# EAGLE schematic at32uc3_proto1 (EAGLE 5.10)
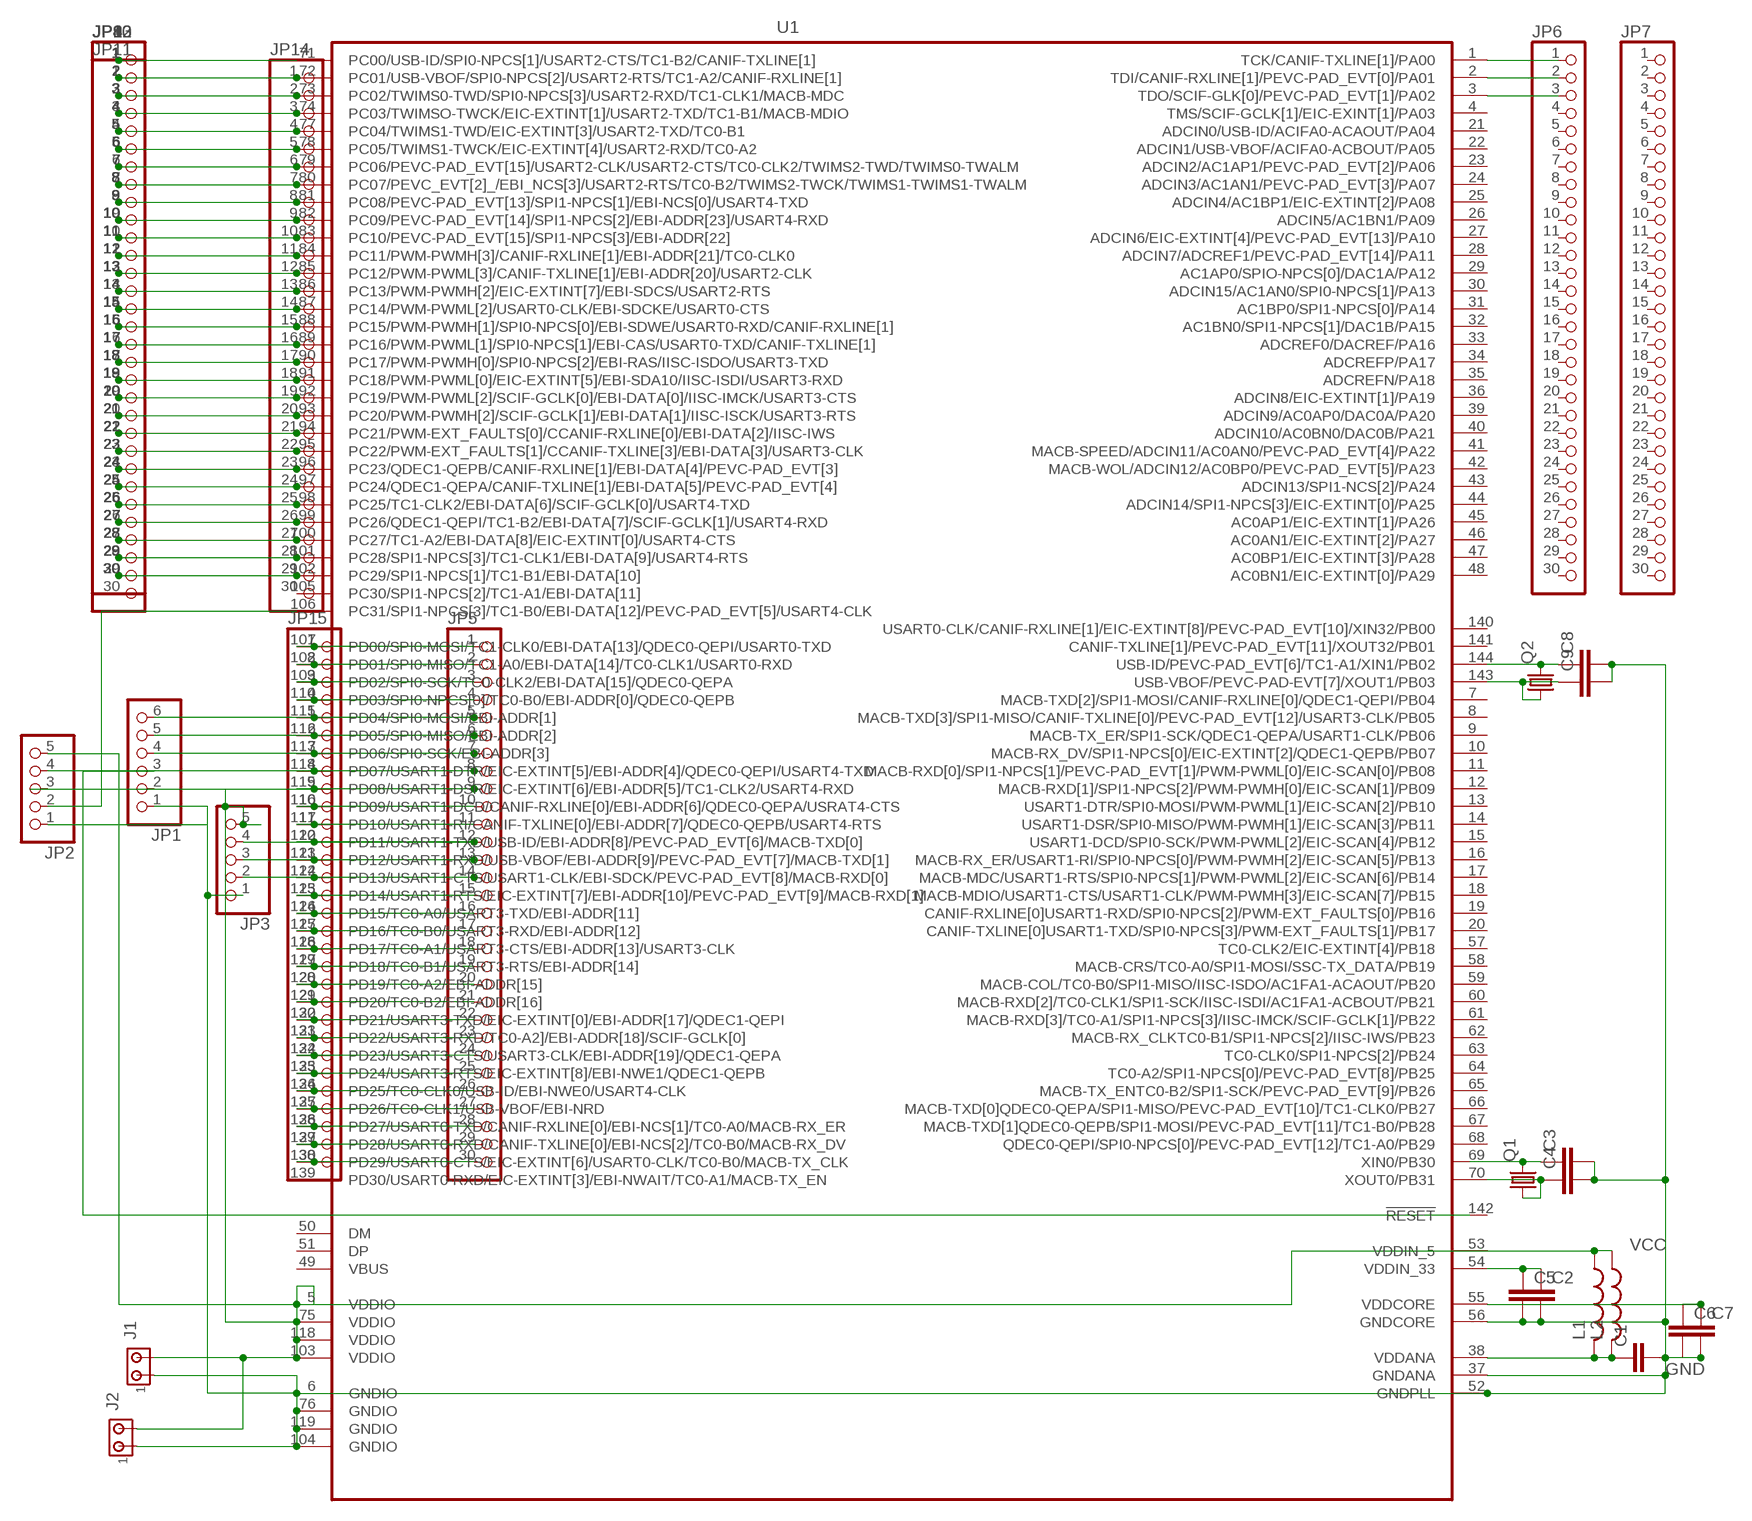
[diagram p0: schematic, sheet 1]

## Parts
C1  C-EU025-050X050  [C025-050X050]
C2  C-EUC1206K  [C1206K]
C3  C-EUC1206K  [C1206K]
C4  C-EUC1206K  [C1206K]
C5  C-EUC1206K  [C1206K]
C6  C-EUC1206K  [C1206K]
C7  C-EUC1206K  [C1206K]
C8  C-EUC1206K  [C1206K]
C9  C-EUC1206K  [C1206K]
J1  MTA02-100  [10X02MTA]
J2  MTA02-100  [10X02MTA]
JP1  PINHD-1X6  [1X06]
JP2  PINHD-1X5  [1X05]
JP3  PINHD-1X5  [1X05]
JP4  PINHD-1X30  [1X30]
JP5  PINHD-1X30  [1X30]
JP6  PINHD-1X30  [1X30]
JP7  PINHD-1X30  [1X30]
JP8  PINHD-1X30  [1X30]
JP9  PINHD-1X30  [1X30]
JP10  PINHD-1X30  [1X30]
JP11  PINHD-1X30  [1X30]
JP12  PINHD-1X30  [1X30]
JP13  PINHD-1X30  [1X30]
JP14  PINHD-1X30  [1X30]
JP15  PINHD-1X30  [1X30]
L1  L-US0207/10  [0207/10]
L2  L-USL4532C  [L4532M]
Q1  CRYSTALHC49S  [HC49/S]
Q2  CRYSTALHC49S  [HC49/S]
U1  AT32UC3C0128/0256/0512  [LQFP144]

## Nets
GND: C1.2 C2.2 C3.2 C4.2 C5.2 C6.2 C7.2 C8.2 C9.2 J1.1 J2.1 JP1.1 JP2.1 JP3.1 U1.6(GNDIO) U1.37(GNDANA) U1.52(GNDPLL) U1.56(GNDCORE) U1.76(GNDIO) U1.104(GNDIO) U1.119(GNDIO)
N$1: C2.1 C5.1 U1.54(VDDIN_33)
N$2: C4.1 Q1.1 U1.70(XOUT0/PB31)
N$3: C1.1 L1.2 L2.2 U1.38(VDDANA)
N$4: C3.1 Q1.2
N$5: C6.1 C7.1 U1.55(VDDCORE)
N$6: C8.1 Q2.2 U1.144(USB-ID/PEVC-PAD_EVT[6]/TC1-A1/XIN1/PB02)
N$7: C9.1 Q2.1 U1.143(USB-VBOF/PEVC-PAD-EVT[7]/XOUT1/PB03)
N$8: JP1.6 JP5.5 JP15.5 U1.111(PD04/SPI0-MOSI/EBI-ADDR[1])
N$9: JP1.5 JP5.6 JP15.6 U1.112(PD05/SPI0-MISO/EBI-ADDR[2])
N$10: JP1.4 JP5.7 JP15.7 U1.113(PD06/SPI0-SCK/EBI-ADDR[3])
N$11: JP1.3
N$12: JP2.4 JP5.8 JP15.8 U1.114(PD07/USART1-DTR/EIC-EXTINT[5]/EBI-ADDR[4]/QDEC0-QEPI/USART4-TXD)
N$13: JP5.9 JP15.9 U1.115(PD08/USART1-DSR/EIC-EXTINT[6]/EBI-ADDR[5]/TC1-CLK2/USART4-RXD)
N$14: JP2.2 U1.106(PC31/SPI1-NPCS[3]/TC1-B0/EBI-DATA[12]/PEVC-PAD_EVT[5]/USART4-CLK)
N$15: JP4.1 JP8.1 JP9.1 JP10.1 JP12.1 JP13.1 U1.71(PC00/USB-ID/SPI0-NPCS[1]/USART2-CTS/TC1-B2/CANIF-TXLINE[1])
N$16: JP3.4 JP5.12 JP15.12 U1.120(PD11/USART1-TXD/USB-ID/EBI-ADDR[8]/PEVC-PAD_EVT[6]/MACB-TXD[0])
N$17: JP3.3 JP5.13 JP15.13 U1.121(PD12/USART1-RXD/USB-VBOF/EBI-ADDR[9]/PEVC-PAD_EVT[7]/MACB-TXD[1])
N$18: JP3.2 JP5.14 JP15.14 U1.122(PD13/USART1-CTS/USART1-CLK/EBI-SDCK/PEVC-PAD_EVT[8]/MACB-RXD[0])
N$19: JP4.2 JP8.2 JP9.2 JP10.2 JP11.1 JP12.2 JP13.2 JP14.1 U1.72(PC01/USB-VBOF/SPI0-NPCS[2]/USART2-RTS/TC1-A2/CANIF-RXLINE[1])
N$20: JP4.3 JP8.3 JP9.3 JP10.3 JP11.2 JP12.3 JP13.3 JP14.2 U1.73(PC02/TWIMS0-TWD/SPI0-NPCS[3]/USART2-RXD/TC1-CLK1/MACB-MDC)
N$21: JP4.4 JP8.4 JP9.4 JP10.4 JP11.3 JP12.4 JP13.4 JP14.3 U1.74(PC03/TWIMSO-TWCK/EIC-EXTINT[1]/USART2-TXD/TC1-B1/MACB-MDIO)
N$22: JP4.5 JP8.5 JP9.5 JP10.5 JP11.4 JP12.5 JP13.5 JP14.4 U1.77(PC04/TWIMS1-TWD/EIC-EXTINT[3]/USART2-TXD/TC0-B1)
N$23: JP4.6 JP8.6 JP9.6 JP10.6 JP11.5 JP12.6 JP13.6 JP14.5 U1.78(PC05/TWIMS1-TWCK/EIC-EXTINT[4]/USART2-RXD/TC0-A2)
N$24: JP4.7 JP8.7 JP9.7 JP10.7 JP11.6 JP12.7 JP13.7 JP14.6 U1.79(PC06/PEVC-PAD_EVT[15]/USART2-CLK/USART2-CTS/TC0-CLK2/TWIMS2-TWD/TWIMS0-TWALM)
N$25: JP4.8 JP8.8 JP9.8 JP10.8 JP11.7 JP12.8 JP13.8 JP14.7 U1.80(PC07/PEVC_EVT[2]_/EBI_NCS[3]/USART2-RTS/TC0-B2/TWIMS2-TWCK/TWIMS1-TWIMS1-TWALM)
N$26: JP4.9 JP8.9 JP9.9 JP10.9 JP11.8 JP12.9 JP13.9 JP14.8 U1.81(PC08/PEVC-PAD_EVT[13]/SPI1-NPCS[1]/EBI-NCS[0]/USART4-TXD)
N$27: JP4.10 JP8.10 JP9.10 JP10.10 JP11.9 JP12.10 JP13.10 JP14.9 U1.82(PC09/PEVC-PAD_EVT[14]/SPI1-NPCS[2]/EBI-ADDR[23]/USART4-RXD)
N$28: JP4.11 JP8.11 JP9.11 JP10.11 JP11.10 JP12.11 JP13.11 JP14.10 U1.83(PC10/PEVC-PAD_EVT[15]/SPI1-NPCS[3]/EBI-ADDR[22])
N$29: JP4.12 JP8.12 JP9.12 JP10.12 JP11.11 JP12.12 JP13.12 JP14.11 U1.84(PC11/PWM-PWMH[3]/CANIF-RXLINE[1]/EBI-ADDR[21]/TC0-CLK0)
N$30: JP4.13 JP8.13 JP9.13 JP10.13 JP11.12 JP12.13 JP13.13 JP14.12 U1.85(PC12/PWM-PWML[3]/CANIF-TXLINE[1]/EBI-ADDR[20]/USART2-CLK)
N$31: JP4.14 JP8.14 JP9.14 JP10.14 JP11.13 JP12.14 JP13.14 JP14.13 U1.86(PC13/PWM-PWMH[2]/EIC-EXTINT[7]/EBI-SDCS/USART2-RTS)
N$32: JP4.15 JP8.15 JP9.15 JP10.15 JP11.14 JP12.15 JP13.15 JP14.14 U1.87(PC14/PWM-PWML[2]/USART0-CLK/EBI-SDCKE/USART0-CTS)
N$33: JP4.16 JP8.16 JP9.16 JP10.16 JP11.15 JP12.16 JP13.16 JP14.15 U1.88(PC15/PWM-PWMH[1]/SPI0-NPCS[0]/EBI-SDWE/USART0-RXD/CANIF-RXLINE[1])
N$34: JP4.17 JP8.17 JP9.17 JP10.17 JP11.16 JP12.17 JP13.17 JP14.16 U1.89(PC16/PWM-PWML[1]/SPI0-NPCS[1]/EBI-CAS/USART0-TXD/CANIF-TXLINE[1])
N$35: JP4.18 JP8.18 JP9.18 JP10.18 JP11.17 JP12.18 JP13.18 JP14.17 U1.90(PC17/PWM-PWMH[0]/SPI0-NPCS[2]/EBI-RAS/IISC-ISDO/USART3-TXD)
N$36: JP4.19 JP8.19 JP9.19 JP10.19 JP11.18 JP12.19 JP13.19 JP14.18 U1.91(PC18/PWM-PWML[0]/EIC-EXTINT[5]/EBI-SDA10/IISC-ISDI/USART3-RXD)
N$37: JP4.20 JP8.20 JP9.20 JP10.20 JP11.19 JP12.20 JP13.20 JP14.19 U1.92(PC19/PWM-PWML[2]/SCIF-GCLK[0]/EBI-DATA[0]/IISC-IMCK/USART3-CTS)
N$38: JP4.21 JP8.21 JP9.21 JP10.21 JP11.20 JP12.21 JP13.21 JP14.20 U1.93(PC20/PWM-PWMH[2]/SCIF-GCLK[1]/EBI-DATA[1]/IISC-ISCK/USART3-RTS)
N$39: JP4.22 JP8.22 JP9.22 JP10.22 JP11.21 JP12.22 JP13.22 JP14.21 U1.94(PC21/PWM-EXT_FAULTS[0]/CCANIF-RXLINE[0]/EBI-DATA[2]/IISC-IWS)
N$40: JP4.23 JP8.23 JP9.23 JP10.23 JP11.22 JP12.23 JP13.23 JP14.22 U1.95(PC22/PWM-EXT_FAULTS[1]/CCANIF-TXLINE[3]/EBI-DATA[3]/USART3-CLK)
N$41: JP4.24 JP8.24 JP9.24 JP10.24 JP11.23 JP12.24 JP13.24 JP14.23 U1.96(PC23/QDEC1-QEPB/CANIF-RXLINE[1]/EBI-DATA[4]/PEVC-PAD_EVT[3])
N$42: JP4.25 JP8.25 JP9.25 JP10.25 JP11.24 JP12.25 JP13.25 JP14.24 U1.97(PC24/QDEC1-QEPA/CANIF-TXLINE[1]/EBI-DATA[5]/PEVC-PAD_EVT[4])
N$43: JP4.26 JP8.26 JP9.26 JP10.26 JP11.25 JP12.26 JP13.26 JP14.25 U1.98(PC25/TC1-CLK2/EBI-DATA[6]/SCIF-GCLK[0]/USART4-TXD)
N$44: JP4.27 JP8.27 JP9.27 JP10.27 JP11.26 JP12.27 JP13.27 JP14.26 U1.99(PC26/QDEC1-QEPI/TC1-B2/EBI-DATA[7]/SCIF-GCLK[1]/USART4-RXD)
N$45: JP4.28 JP8.28 JP9.28 JP10.28 JP11.27 JP12.28 JP13.28 JP14.27 U1.100(PC27/TC1-A2/EBI-DATA[8]/EIC-EXTINT[0]/USART4-CTS)
N$46: JP4.29 JP8.29 JP9.29 JP10.29 JP11.28 JP12.29 JP13.29 JP14.28 U1.101(PC28/SPI1-NPCS[3]/TC1-CLK1/EBI-DATA[9]/USART4-RTS)
N$47: JP4.30 JP8.30 JP9.30 JP10.30 JP11.29 JP12.30 JP13.30 JP14.29 U1.102(PC29/SPI1-NPCS[1]/TC1-B1/EBI-DATA[10])
N$48: JP5.1 JP15.1 U1.107(PD00/SPI0-MOSI/TC1-CLK0/EBI-DATA[13]/QDEC0-QEPI/USART0-TXD)
N$49: JP5.2 JP15.2 U1.108(PD01/SPI0-MISO/TC1-A0/EBI-DATA[14]/TC0-CLK1/USART0-RXD)
N$50: JP5.3 JP15.3 U1.109(PD02/SPI0-SCK/TC0-CLK2/EBI-DATA[15]/QDEC0-QEPA)
N$51: JP5.4 JP15.4 U1.110(PD03/SPI0-NPCS[0]/TC0-B0/EBI-ADDR[0]/QDEC0-QEPB)
N$52: JP5.10 JP15.10 U1.116(PD09/USART1-DCD/CANIF-RXLINE[0]/EBI-ADDR[6]/QDEC0-QEPA/USRAT4-CTS)
N$53: JP5.11 JP15.11 U1.117(PD10/USART1-RI/CANIF-TXLINE[0]/EBI-ADDR[7]/QDEC0-QEPB/USART4-RTS)
N$54: JP5.15 JP15.15 U1.123(PD14/USART1-RTS/EIC-EXTINT[7]/EBI-ADDR[10]/PEVC-PAD_EVT[9]/MACB-RXD[1])
N$55: JP5.16 JP15.16 U1.124(PD15/TC0-A0/USART3-TXD/EBI-ADDR[11])
N$56: JP5.17 JP15.17 U1.125(PD16/TC0-B0/USART3-RXD/EBI-ADDR[12])
N$57: JP5.18 JP15.18 U1.126(PD17/TC0-A1/USART3-CTS/EBI-ADDR[13]/USART3-CLK)
N$58: JP5.19 JP15.19 U1.127(PD18/TC0-B1/USART3-RTS/EBI-ADDR[14])
N$59: JP5.20 JP15.20 U1.128(PD19/TC0-A2/EBI-ADDR[15])
N$60: JP5.21 JP15.21 U1.129(PD20/TC0-B2/EBI-ADDR[16])
N$61: JP5.22 JP15.22 U1.130(PD21/USART3-TXD/EIC-EXTINT[0]/EBI-ADDR[17]/QDEC1-QEPI)
N$62: JP5.23 JP15.23 U1.131(PD22/USART3-RXD/TC0-A2]/EBI-ADDR[18]/SCIF-GCLK[0])
N$63: JP5.24 JP15.24 U1.132(PD23/USART3-CTS/USART3-CLK/EBI-ADDR[19]/QDEC1-QEPA)
N$64: JP5.25 JP15.25 U1.133(PD24/USART3-RTS/EIC-EXTINT[8]/EBI-NWE1/QDEC1-QEPB)
N$65: JP5.26 JP15.26 U1.134(PD25/TC0-CLK0/USB-ID/EBI-NWE0/USART4-CLK)
N$66: JP5.27 JP15.27 U1.135(PD26/TC0-CLK1/USB-VBOF/EBI-NRD)
N$67: JP5.28 JP15.28 U1.136(PD27/USART0-TXD/CANIF-RXLINE[0]/EBI-NCS[1]/TC0-A0/MACB-RX_ER)
N$68: JP5.29 JP15.29 U1.137(PD28/USART0-RXD/CANIF-TXLINE[0]/EBI-NCS[2]/TC0-B0/MACB-RX_DV)
N$69: JP5.30 JP15.30 U1.138(PD29/USART0-CTS/EIC-EXTINT[6]/USART0-CLK/TC0-B0/MACB-TX_CLK)
N$70: JP14.30 U1.105(PC30/SPI1-NPCS[2]/TC1-A1/EBI-DATA[11])
N$71: JP6.1 U1.1(TCK/CANIF-TXLINE[1]/PA00)
N$72: JP6.2 U1.2(TDI/CANIF-RXLINE[1]/PEVC-PAD_EVT[0]/PA01)
N$73: JP6.3 U1.3(TDO/SCIF-GLK[0]/PEVC-PAD_EVT[1]/PA02)
VCC: J1.2 J2.2 JP1.2 JP2.5 JP3.5 L1.1 L2.1 U1.5(VDDIO) U1.53(VDDIN_5) U1.75(VDDIO) U1.103(VDDIO) U1.118(VDDIO)
Unconnected: JP2.3 JP6.4 JP6.5 JP6.6 JP6.7 JP6.8 JP6.9 JP6.10 JP6.11 JP6.12 JP6.13 JP6.14 JP6.15 JP6.16 JP6.17 JP6.18 JP6.19 JP6.20 JP6.21 JP6.22 JP6.23 JP6.24 JP6.25 JP6.26 JP6.27 JP6.28 JP6.29 JP6.30 JP7.1 JP7.2 JP7.3 JP7.4 JP7.5 JP7.6 JP7.7 JP7.8 JP7.9 JP7.10 JP7.11 JP7.12 JP7.13 JP7.14 JP7.15 JP7.16 JP7.17 JP7.18 JP7.19 JP7.20 JP7.21 JP7.22 JP7.23 JP7.24 JP7.25 JP7.26 JP7.27 JP7.28 JP7.29 JP7.30 JP11.30 U1.4(TMS/SCIF-GCLK[1]/EIC-EXINT[1]/PA03) U1.7(MACB-TXD[2]/SPI1-MOSI/CANIF-RXLINE[0]/QDEC1-QEPI/PB04) U1.8(MACB-TXD[3]/SPI1-MISO/CANIF-TXLINE[0]/PEVC-PAD_EVT[12]/USART3-CLK/PB05) U1.9(MACB-TX_ER/SPI1-SCK/QDEC1-QEPA/USART1-CLK/PB06) U1.10(MACB-RX_DV/SPI1-NPCS[0]/EIC-EXTINT[2]/QDEC1-QEPB/PB07) U1.11(MACB-RXD[0]/SPI1-NPCS[1]/PEVC-PAD_EVT[1]/PWM-PWML[0]/EIC-SCAN[0]/PB08) U1.12(MACB-RXD[1]/SPI1-NPCS[2]/PWM-PWMH[0]/EIC-SCAN[1]/PB09) U1.13(USART1-DTR/SPI0-MOSI/PWM-PWML[1]/EIC-SCAN[2]/PB10) U1.14(USART1-DSR/SPI0-MISO/PWM-PWMH[1]/EIC-SCAN[3]/PB11) U1.15(USART1-DCD/SPI0-SCK/PWM-PWML[2]/EIC-SCAN[4]/PB12) U1.16(MACB-RX_ER/USART1-RI/SPI0-NPCS[0]/PWM-PWMH[2]/EIC-SCAN[5]/PB13) U1.17(MACB-MDC/USART1-RTS/SPI0-NPCS[1]/PWM-PWML[2]/EIC-SCAN[6]/PB14) U1.18(MACB-MDIO/USART1-CTS/USART1-CLK/PWM-PWMH[3]/EIC-SCAN[7]/PB15) U1.19(CANIF-RXLINE[0]USART1-RXD/SPI0-NPCS[2]/PWM-EXT_FAULTS[0]/PB16) U1.20(CANIF-TXLINE[0]USART1-TXD/SPI0-NPCS[3]/PWM-EXT_FAULTS[1]/PB17) U1.21(ADCIN0/USB-ID/ACIFA0-ACAOUT/PA04) U1.22(ADCIN1/USB-VBOF/ACIFA0-ACBOUT/PA05) U1.23(ADCIN2/AC1AP1/PEVC-PAD_EVT[2]/PA06) U1.24(ADCIN3/AC1AN1/PEVC-PAD_EVT[3]/PA07) U1.25(ADCIN4/AC1BP1/EIC-EXTINT[2]/PA08) U1.26(ADCIN5/AC1BN1/PA09) U1.27(ADCIN6/EIC-EXTINT[4]/PEVC-PAD_EVT[13]/PA10) U1.28(ADCIN7/ADCREF1/PEVC-PAD_EVT[14]/PA11) U1.29(AC1AP0/SPIO-NPCS[0]/DAC1A/PA12) U1.30(ADCIN15/AC1AN0/SPI0-NPCS[1]/PA13) U1.31(AC1BP0/SPI1-NPCS[0]/PA14) U1.32(AC1BN0/SPI1-NPCS[1]/DAC1B/PA15) U1.33(ADCREF0/DACREF/PA16) U1.34(ADCREFP/PA17) U1.35(ADCREFN/PA18) U1.36(ADCIN8/EIC-EXTINT[1]/PA19) U1.39(ADCIN9/AC0AP0/DAC0A/PA20) U1.40(ADCIN10/AC0BN0/DAC0B/PA21) U1.41(MACB-SPEED/ADCIN11/AC0AN0/PEVC-PAD_EVT[4]/PA22) U1.42(MACB-WOL/ADCIN12/AC0BP0/PEVC-PAD_EVT[5]/PA23) U1.43(ADCIN13/SPI1-NCS[2]/PA24) U1.44(ADCIN14/SPI1-NPCS[3]/EIC-EXTINT[0]/PA25) U1.45(AC0AP1/EIC-EXTINT[1]/PA26) U1.46(AC0AN1/EIC-EXTINT[2]/PA27) U1.47(AC0BP1/EIC-EXTINT[3]/PA28) U1.48(AC0BN1/EIC-EXTINT[0]/PA29) U1.49(VBUS) U1.50(DM) U1.51(DP) U1.57(TC0-CLK2/EIC-EXTINT[4]/PB18) U1.58(MACB-CRS/TC0-A0/SPI1-MOSI/SSC-TX_DATA/PB19) U1.59(MACB-COL/TC0-B0/SPI1-MISO/IISC-ISDO/AC1FA1-ACAOUT/PB20) U1.60(MACB-RXD[2]/TC0-CLK1/SPI1-SCK/IISC-ISDI/AC1FA1-ACBOUT/PB21) U1.61(MACB-RXD[3]/TC0-A1/SPI1-NPCS[3]/IISC-IMCK/SCIF-GCLK[1]/PB22) U1.62(MACB-RX_CLKTC0-B1/SPI1-NPCS[2]/IISC-IWS/PB23) U1.63(TC0-CLK0/SPI1-NPCS[2]/PB24) U1.64(TC0-A2/SPI1-NPCS[0]/PEVC-PAD_EVT[8]/PB25) U1.65(MACB-TX_ENTC0-B2/SPI1-SCK/PEVC-PAD_EVT[9]/PB26) U1.66(MACB-TXD[0]QDEC0-QEPA/SPI1-MISO/PEVC-PAD_EVT[10]/TC1-CLK0/PB27) U1.67(MACB-TXD[1]QDEC0-QEPB/SPI1-MOSI/PEVC-PAD_EVT[11]/TC1-B0/PB28) U1.68(QDEC0-QEPI/SPI0-NPCS[0]/PEVC-PAD_EVT[12]/TC1-A0/PB29) U1.69(XIN0/PB30) U1.139(PD30/USART0-RXD/EIC-EXTINT[3]/EBI-NWAIT/TC0-A1/MACB-TX_EN) U1.140(USART0-CLK/CANIF-RXLINE[1]/EIC-EXTINT[8]/PEVC-PAD_EVT[10]/XIN32/PB00) U1.141(CANIF-TXLINE[1]/PEVC-PAD_EVT[11]/XOUT32/PB01) U1.142(!RESET)

## Library data of the parts
C1-C9 = rcl:C-EU: CAPACITOR, European symbol
J1 J2 = con-amp:MTA02-100: AMP connector
JP1 = pinhead:PINHD-1X6: PIN HEADER
JP2 JP3 = pinhead:PINHD-1X5: PIN HEADER
JP4-JP15 = pinhead:PINHD-1X30: PIN HEADER
L1 L2 = rcl:L-US: INDUCTOR, American symbol
Q1 Q2 = crystal:CRYSTAL: CRYSTAL
U1 = atmel-avr32-michel-rev1 - Copy:AT32UC3C0128/0256/0512: AT32UC3C0128/0256/0512